# EAGLE schematic entireboard_v1 (EAGLE 9.2.0)

## Sheet 1 of 2
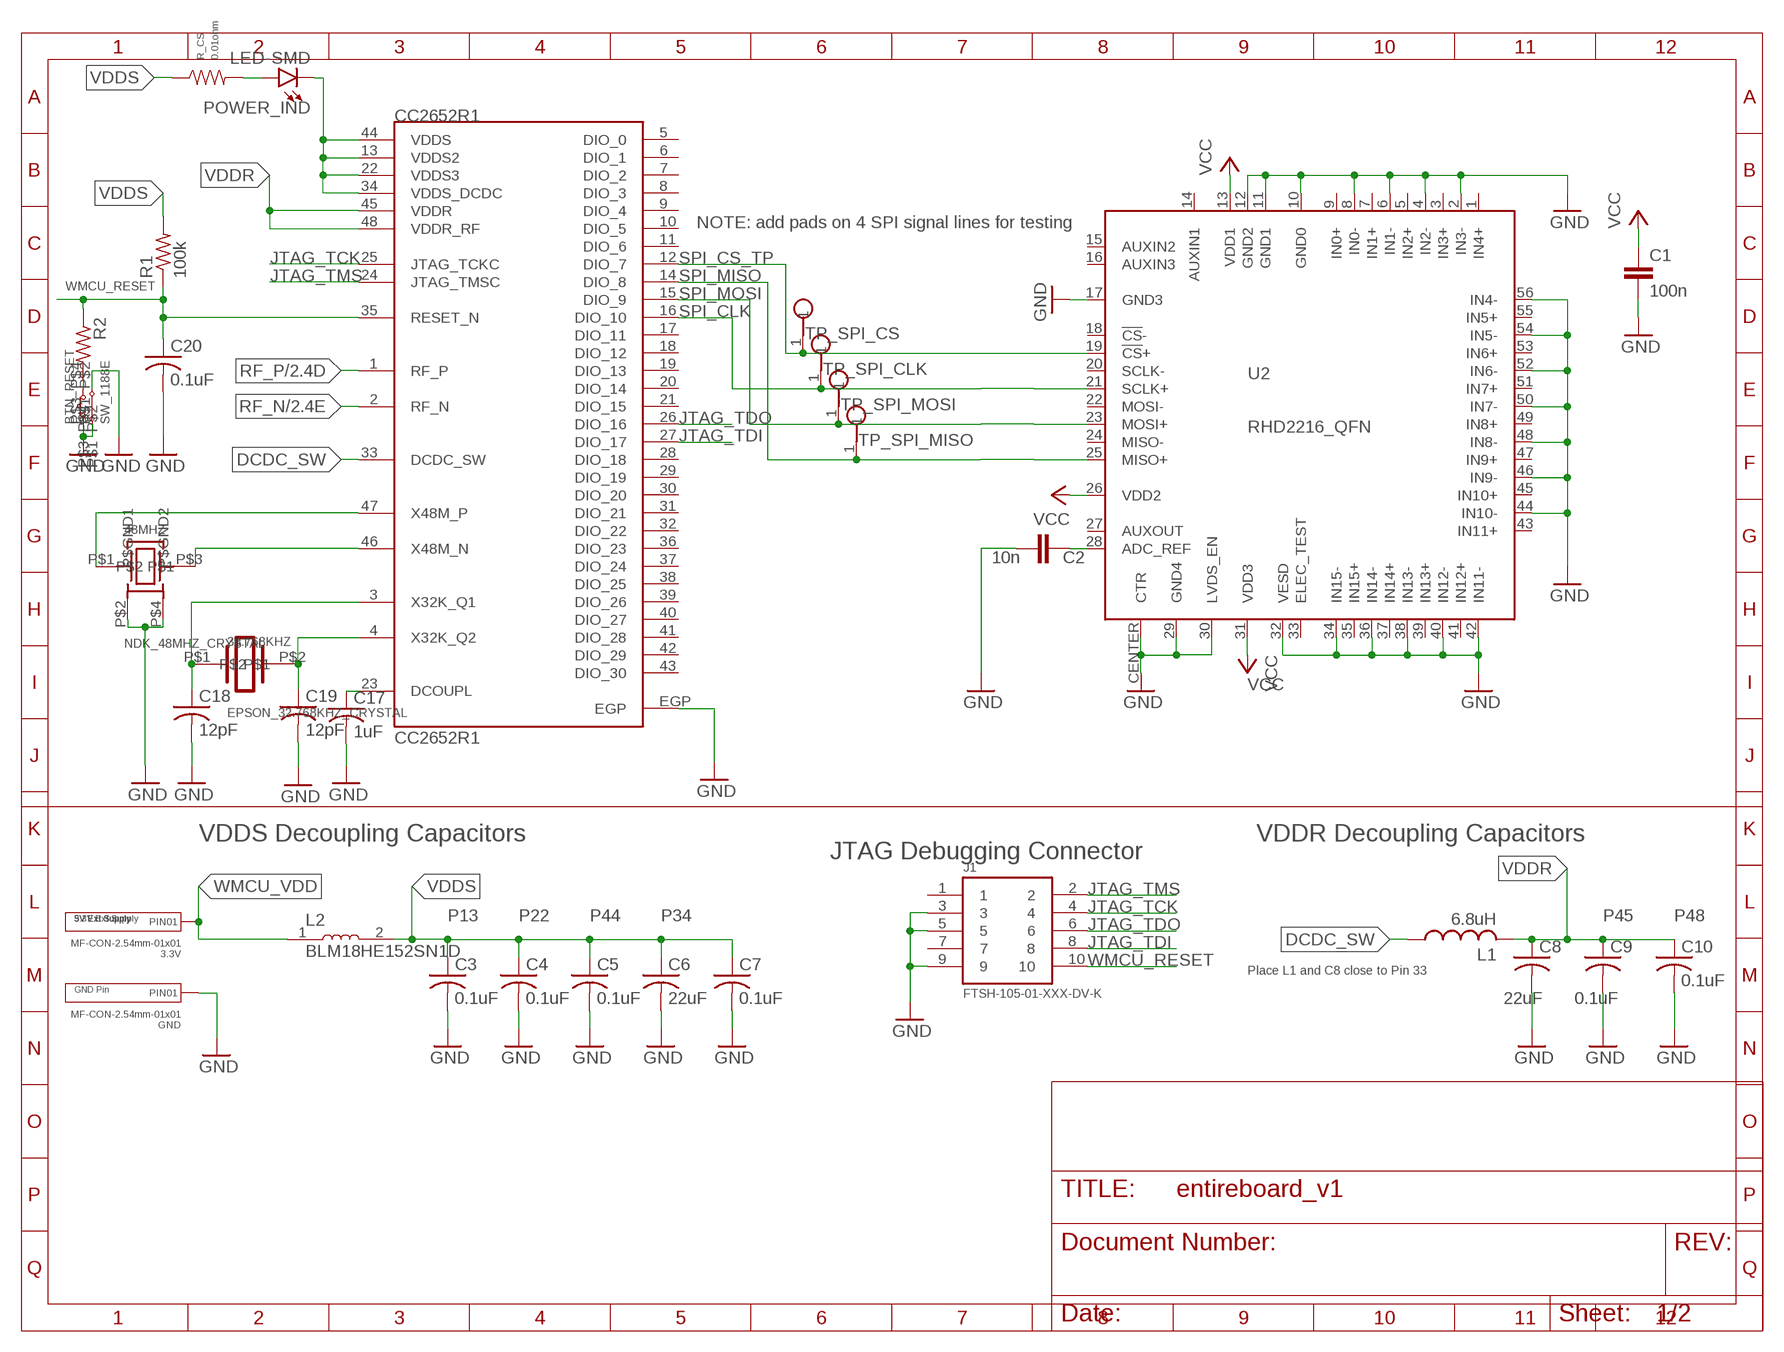
[diagram p0: schematic, sheet 1]

### Parts
3.3V  MF-CON-2.54mm-01x01  CON_01X01_PTH_2.54MM  [PTH_2.54MM_01X01]
38.768KHZ  EPSON_32.768KHZ_CRYSTAL  [2-SMD]
48MHZ  NDK_48MHZ_CRYSTAL  [4-SMD]
BTN_RESET  SW_1188E  [SW_1188E]
C1  100n  C_0402  [0402]
C2  10n  C_0402  [0402]
C3  0.1uF  C-USC0402  [C0402]
C4  0.1uF  C-USC0402  [C0402]
C5  0.1uF  C-USC0402  [C0402]
C6  22uF  C-USC0402  [C0402]
C7  0.1uF  C-USC0402  [C0402]
C8  22uF  C-USC0402  [C0402]
C9  0.1uF  C-USC0402  [C0402]
C10  0.1uF  C-USC0402  [C0402]
C17  1uF  C-USC0402  [C0402]
C18  12pF  C-USC0402  [C0402]
C19  12pF  C-USC0402  [C0402]
C20  0.1uF  C-USC0402  [C0402]
CC2652R1  CC2652R1  [CC2652R1_QFN-48]
GND  MF-CON-2.54mm-01x01  CON_01X01_PTH_2.54MM  [PTH_2.54MM_01X01]
J1  FTSH-105-01-XXX-DV-K  [FTSH-105-01-XXX-DV-K]
L1  6.8uH  L-SMD  [RHD2000_EVAL_BOARD_0805]
L2  BLM18HE152SN1D  [INDC1608X95]
POWER_IND  LED-SMD  [RHD2000_EVAL_BOARD_0402]
R1  100k  R-US_R0402  [R0402]
R2  R-US_R0402  [R0402]
R_CS  0.01ohm  RESISTOR_0402  [R0402]
TP_SPI_CLK  RHD2000_EVAL_BOARD_TESTPOINT_SMALL  [RHD2000_EVAL_BOARD_TESTPOINT_SMALL]
TP_SPI_CS  RHD2000_EVAL_BOARD_TESTPOINT_SMALL  [RHD2000_EVAL_BOARD_TESTPOINT_SMALL]
TP_SPI_MISO  RHD2000_EVAL_BOARD_TESTPOINT_SMALL  [RHD2000_EVAL_BOARD_TESTPOINT_SMALL]
TP_SPI_MOSI  RHD2000_EVAL_BOARD_TESTPOINT_SMALL  [RHD2000_EVAL_BOARD_TESTPOINT_SMALL]
U2  RHD2216_QFN  [QFN56_8_X_8_LARGE]

### Nets
DCDC_SW: CC2652R1.33(DCDC_SW) L1.1
GND: 48MHZ.P$2(P$GND1) 48MHZ.P$4(P$GND2) BTN_RESET.P$1 BTN_RESET.P$2 BTN_RESET.P$3 C1.2 C2.2 C3.2 C4.2 C5.2 C6.2 C7.2 C8.2 C9.2 C10.2 C17.2 C18.2 C19.2 C20.2 CC2652R1.EGP GND.P$1(PIN1) J1.3 J1.5 J1.9 U2.2(IN3-) U2.4(IN2-) U2.6(IN1-) U2.8(IN0-) U2.10(GND0) U2.11(GND1) U2.12(GND2) U2.17(GND3) U2.29(GND4) U2.30(LVDS_EN) U2.32(VESD) U2.34(IN15-) U2.36(IN14-) U2.38(IN13-) U2.40(IN12-) U2.42(IN11-) U2.44(IN10-) U2.46(IN9-) U2.48(IN8-) U2.50(IN7-) U2.52(IN6-) U2.54(IN5-) U2.56(IN4-) U2.CENTER(CTR) ; also sheet 2
JTAG_TCK: CC2652R1.25(JTAG_TCKC) J1.4
JTAG_TDI: CC2652R1.27(DIO_17) J1.8
JTAG_TDO: CC2652R1.26(DIO_16) J1.6
JTAG_TMS: CC2652R1.24(JTAG_TMSC) J1.2
N$1: C17.1 CC2652R1.23(DCOUPL)
N$3: 48MHZ.P$1 CC2652R1.47(X48M_P)
N$4: 48MHZ.P$3 CC2652R1.46(X48M_N)
N$5: 38.768KHZ.P$1 C18.1 CC2652R1.3(X32K_Q1)
N$10: 38.768KHZ.P$2 C19.1 CC2652R1.4(X32K_Q2)
N$13: POWER_IND.1(A) R_CS.P$2
N$16: BTN_RESET.P$4 R2.2
N$42: C2.1 U2.28(ADC_REF)
RF_N: CC2652R1.2(RF_N) ; also sheet 2
RF_P: CC2652R1.1(RF_P) ; also sheet 2
SPI_CLK: CC2652R1.16(DIO_10) TP_SPI_CLK.1 U2.21(SCLK+)
SPI_CS_TP: CC2652R1.12(DIO_7) TP_SPI_CS.1 U2.19(!CS!+)
SPI_MISO: CC2652R1.14(DIO_8) TP_SPI_MISO.1 U2.25(MISO+)
SPI_MOSI: CC2652R1.15(DIO_9) TP_SPI_MOSI.1 U2.23(MOSI+)
VCC: C1.1 U2.13(VDD1) U2.26(VDD2) U2.31(VDD3)
VDDR: C8.1 C9.1 C10.1 CC2652R1.45(VDDR) CC2652R1.48(VDDR_RF) L1.2
VDDS: C3.1 C4.1 C5.1 C6.1 C7.1 CC2652R1.13(VDDS2) CC2652R1.22(VDDS3) CC2652R1.34(VDDS_DCDC) CC2652R1.44(VDDS) L2.2 POWER_IND.2(C) R1.2 R_CS.P$1
WMCU_RESET: C20.1 CC2652R1.35(RESET_N) J1.10 R1.1 R2.1
WMCU_VDD: 3.3V.P$1(PIN1) L2.1
Unconnected: CC2652R1.5(DIO_0) CC2652R1.6(DIO_1) CC2652R1.7(DIO_2) CC2652R1.8(DIO_3) CC2652R1.9(DIO_4) CC2652R1.10(DIO_5) CC2652R1.11(DIO_6) CC2652R1.17(DIO_11) CC2652R1.18(DIO_12) CC2652R1.19(DIO_13) CC2652R1.20(DIO_14) CC2652R1.21(DIO_15) CC2652R1.28(DIO_18) CC2652R1.29(DIO_19) CC2652R1.30(DIO_20) CC2652R1.31(DIO_21) CC2652R1.32(DIO_22) CC2652R1.36(DIO_23) CC2652R1.37(DIO_24) CC2652R1.38(DIO_25) CC2652R1.39(DIO_26) CC2652R1.40(DIO_27) CC2652R1.41(DIO_28) CC2652R1.42(DIO_29) CC2652R1.43(DIO_30) J1.1 J1.7 U2.1(IN4+) U2.3(IN3+) U2.5(IN2+) U2.7(IN1+) U2.9(IN0+) U2.14(AUXIN1) U2.15(AUXIN2) U2.16(AUXIN3) U2.18(!CS!-) U2.20(SCLK-) U2.22(MOSI-) U2.24(MISO-) U2.27(AUXOUT) U2.33(ELEC_TEST) U2.35(IN15+) U2.37(IN14+) U2.39(IN13+) U2.41(IN12+) U2.43(IN11+) U2.45(IN10+) U2.47(IN9+) U2.49(IN8+) U2.51(IN7+) U2.53(IN6+) U2.55(IN5+)

### Notes on the sheet
- NOTE: add pads on 4 SPI signal lines for testing
- VDDS Decoupling Capacitors | VDDR Decoupling Capacitors
- JTAG Debugging Connector
- 3.3V Ext Supply | 5V Ext Supply | 5V Ext Supply | P13 | P22 | P44 | P34 | P45 | P48
- Place L1 and C8 close to Pin 33
- GND Pin

## Sheet 2 of 2
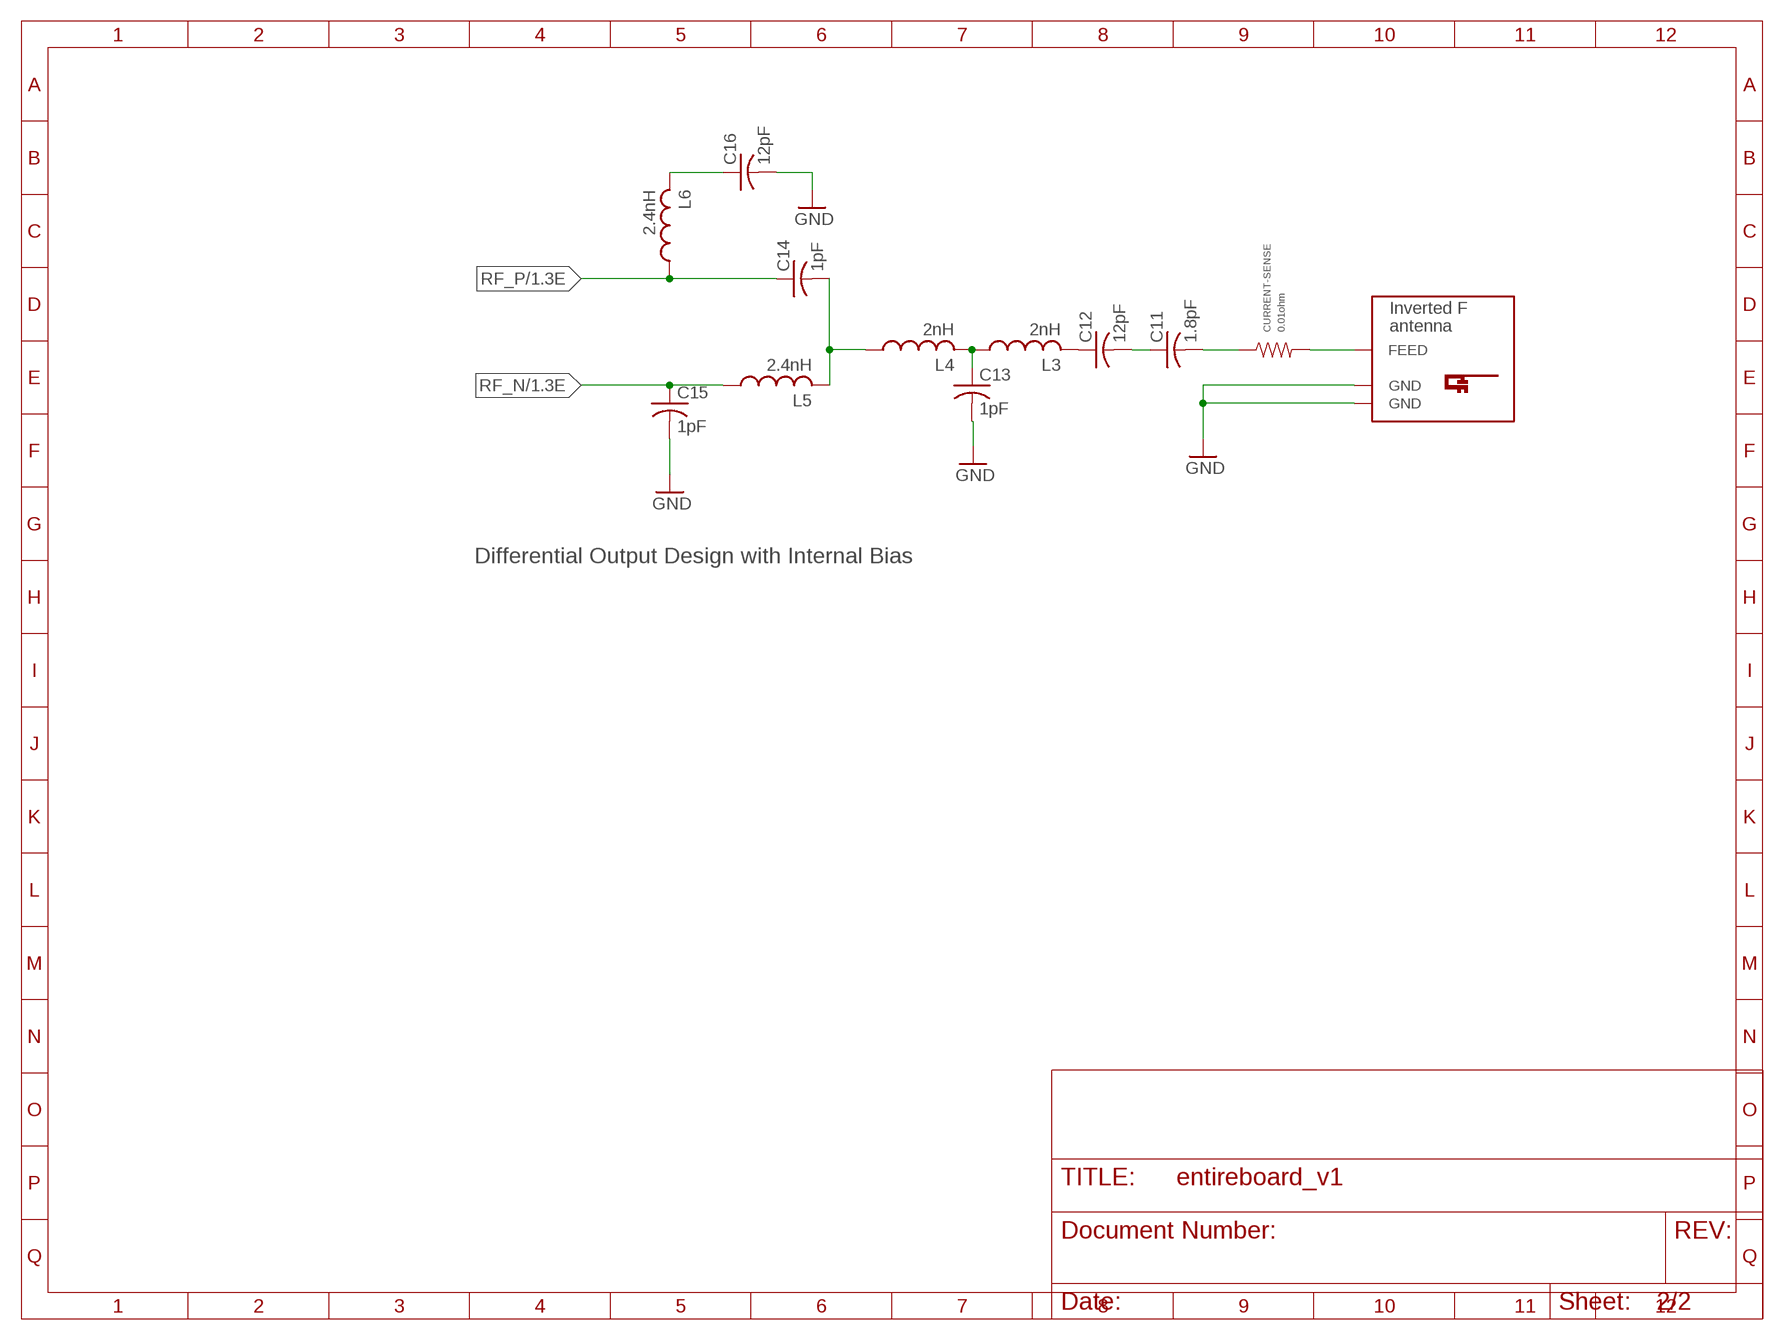
[diagram p1: schematic, sheet 2]

### Parts
C11  1.8pF  C-USC0402  [C0402]
C12  12pF  C-USC0402  [C0402]
C13  1pF  C-USC0402  [C0402]
C14  1pF  C-USC0402  [C0402]
C15  1pF  C-USC0402  [C0402]
C16  12pF  C-USC0402  [C0402]
CURRENT-SENSE  0.01ohm  RESISTOR_0402  [R0402]
L3  2nH  L-SMD  [RHD2000_EVAL_BOARD_0805]
L4  2nH  L-SMD  [RHD2000_EVAL_BOARD_0805]
L5  2.4nH  L-SMD  [RHD2000_EVAL_BOARD_0805]
L6  2.4nH  L-SMD  [RHD2000_EVAL_BOARD_0805]
U$2  INVERTED_F_ANTENNA+0  [DN007+0]

### Nets
GND: C13.2 C15.2 C16.2 U$2.GND U$2.GND@1(GND) ; also sheet 1
N$2: CURRENT-SENSE.P$2 U$2.FEED
N$6: C11.1 C12.2
N$7: C12.1 L3.2
N$8: C13.1 L3.1 L4.2
N$9: C14.2 L4.1 L5.2
N$11: C11.2 CURRENT-SENSE.P$1
N$12: C16.1 L6.2
RF_N: C15.1 L5.1 ; also sheet 1
RF_P: C14.1 L6.1 ; also sheet 1

### Notes on the sheet
- Differential Output Design with Internal Bias

## Library data of the parts
3.3V GND = AxonMobile:CON_01X01: Library: MF_Connectors Description: Header Connector with 01 Positions and 01 Rows. Use the LABEL Attribute to label the pin on the schematic and PCB. You can remove the attributes on the PCB by using the SMASH function on the part and then deleting the text.; HOUSEPART: YES; MPN: MF-CON-2.54mm-01x01; POPULATE: 1; URL: https://factory.macrofab.com/part/MF-CON-2.54mm-01x01
38.768KHZ = AxonMobile:EPSON_32.768KHZ_CRYSTAL
48MHZ = AxonMobile:NDK_48MHZ_CRYSTAL
BTN_RESET = AxonMobile:SW_1188E
C1 C2 = RHD2000_eval_board:C: Capacitor
C3-C20 = adafruit:C-US: CAPACITOR, American symbol
CC2652R1 = AxonMobile:CC2652R1: TI CC2652R1 SimpleLink Multi-Standard Wireless MCU
CURRENT-SENSE R_CS = MF_Passives:RESISTOR: Library: MF_Passives Description: Device for Resistors. Manufacture part number (MPN), Voltage, Tolerance, and Wattage Rating can be added via Attributes. Check https://factory.macrofab.com/parts for the house parts list.; POPULATE: 1
J1 = AxonMobile:FTSH-105-01-XXX-DV-K: 0.05"x0.05" DOUBLE ROW SMT STRIP ASSEMBLY. MANUFACTURER:SAMTEC.
L1 L3-L6 = AxonMobile:L-SMD
L2 = BLM18HE152SN1D:BLM18HE152SN1D: Ferrite Beads Multi-Layer 1.5KOhm 25% 100MHz 500mA 500mOhm DCR 0603 T/R; DIGI-KEY_PART_NUMBER: 490-5216-1-ND; DIGI-KEY_PURCHASE_URL: https://www.digikey.com/product-detail/en/murata-electronics-north-america/BLM18HE152SN1D/490-5216-1-ND/1948392?utm_source=snapeda&utm_medium=aggregator&utm_campaign=symbol; MF: Murata Electronics; MP: BLM18HE152SN1D; PACKAGE: 0603 Samtec
POWER_IND = AxonMobile:LED-SMD
R1 R2 = AxonMobile:R-US_: RESISTOR, American symbol; SPICEPREFIX: R
TP_SPI_CLK TP_SPI_CS TP_SPI_MISO TP_SPI_MOSI = AxonMobile:RHD2000_EVAL_BOARD_TESTPOINT: PCB Test Point
U2 = RHD2000:RHD2216: Intan Technologies RHD2216 chip
U$2 = antenna:INVERTED_F_ANTENNA: 2.4GHz Inverted F Antenna Based on TI Design Note DN007

## Net classes
1 thick: width 1.016 mm
2 power: width 0.61 mm